# EAGLE design usb2lds_v2.0 (EAGLE 6.5.0)
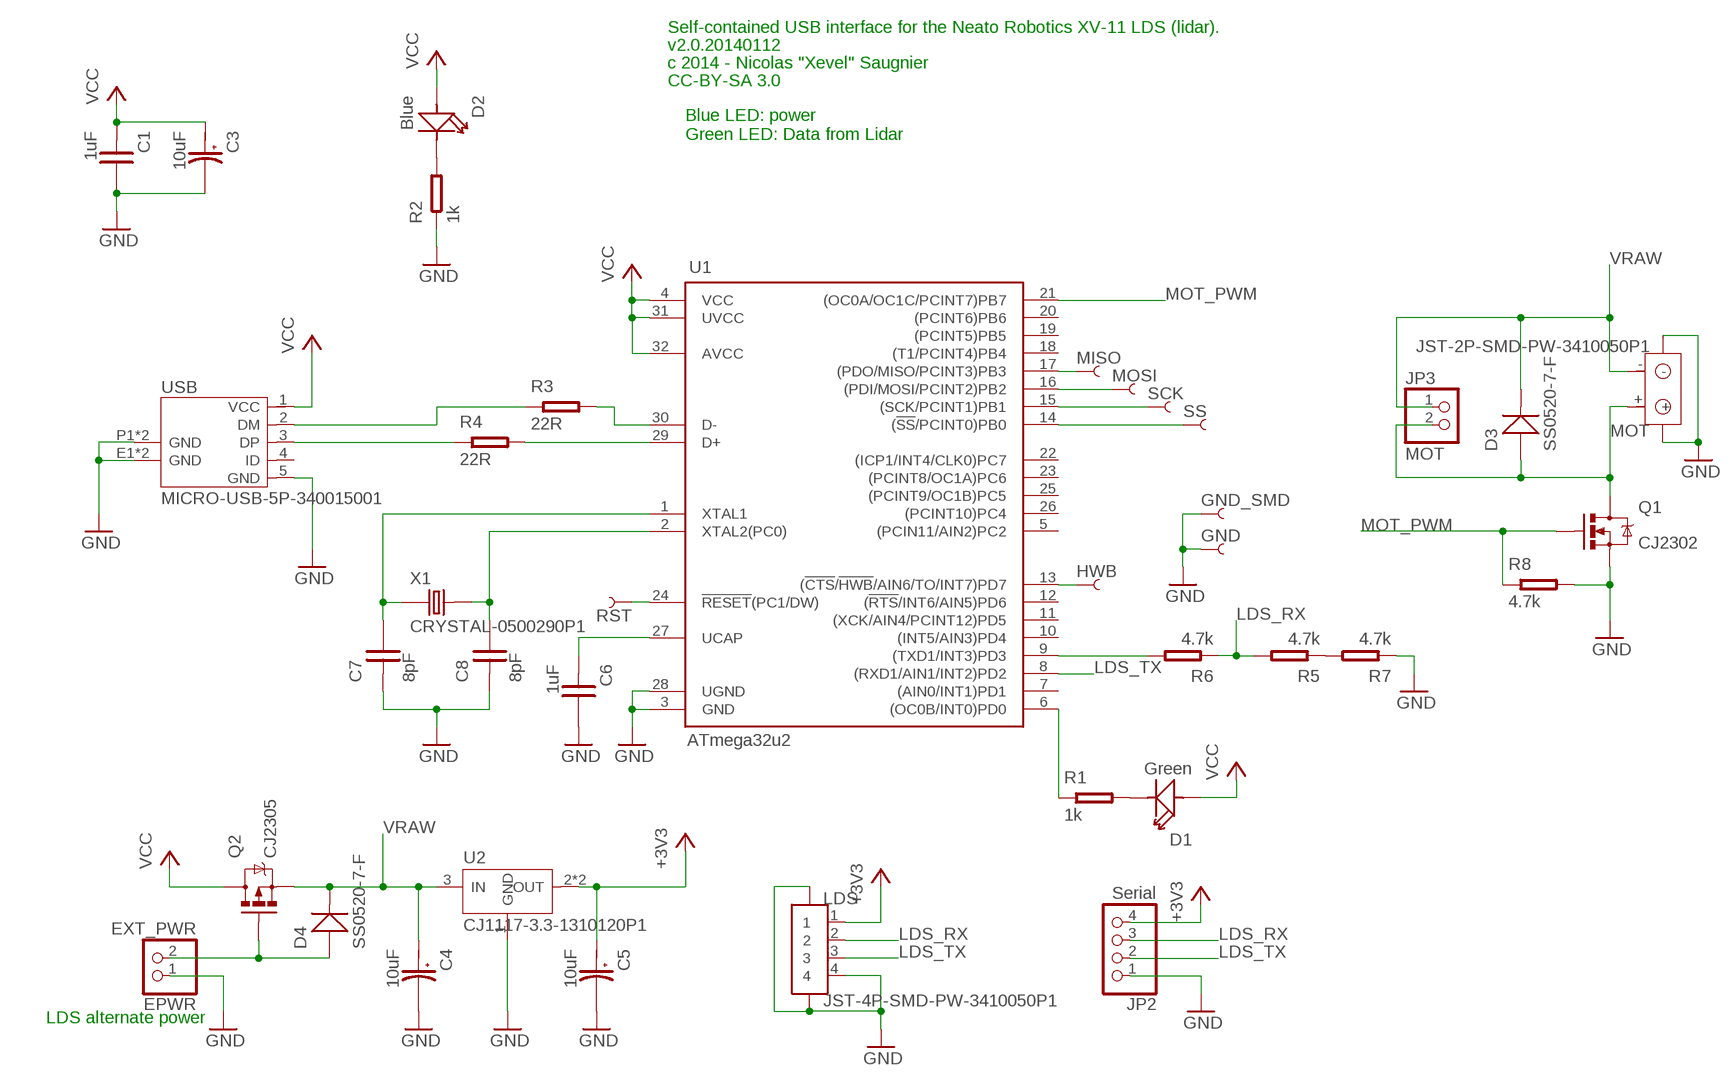
[diagram p0: schematic, sheet 1]

## Parts
C1  1uF  C-0603  [C0603]
C3  10uF  C-POLAR-A  [AVX-A]
C4  10uF  C-POLAR-A  [AVX-A]
C5  10uF  C-POLAR-A  [AVX-A]
C6  1uF  C-0603  [C0603]
C7  8pF  C-0603  [C0603]
C8  8pF  C-0603  [C0603]
D1  Green  LED  [LED0603]
D2  Blue  LED  [LED0603]
D3  SS0520-7-F  D-SOD-123  [SOD123]
D4  SS0520-7-F  D-SOD-123  [SOD123]
EPWR  EXT_PWR  PINHD-1X2  [1X02]
GND  PIN_SMD_2X2.5  [PIN_SMD_2X2.5]
GND_SMD  PIN_SMD_2X2.5  [PIN_SMD_2X2.5]
HWB  PIN_SMD_2X2.5  [PIN_SMD_2X2.5]
JP2  Serial  PINHD-1X4  [1X04]
JP3  MOT  PINHD-1X2  [1X02]
LDS  JST-4P-SMD-PW-3410050P1  [CON-4P-SMD-2.0-90D]
MISO  PIN_SMD_2X2.5  [PIN_SMD_2X2.5]
MOSI  PIN_SMD_2X2.5  [PIN_SMD_2X2.5]
MOT  JST-2P-SMD-PW-3410050P1  [2P-SMD-2.0-90D]
Q1  CJ2302  MOSFET_N_SOT23-3  [SOT-23-3_N/SSOT-3_N]
Q2  CJ2305  MOSFET_P_FDN308P  [SOT-23-3_N/SSOT-3_N]
R1  1k  R-0603  [R0603]
R2  1k  R-0603  [R0603]
R3  22R  R-0603  [R0603]
R4  22R  R-0603  [R0603]
R5  4.7k  R-0603  [R0603]
R6  4.7k  R-0603  [R0603]
R7  4.7k  R-0603  [R0603]
R8  4.7k  R-0603  [R0603]
RST  PIN_SMD_2X2.5  [PIN_SMD_2X2.5]
SCK  PIN_SMD_2X2.5  [PIN_SMD_2X2.5]
SS  PIN_SMD_2X2.5  [PIN_SMD_2X2.5]
U1  ATmega32u2  IC_ATMEGAXXU2-MU_L_MOD  [QFN-32_50P_L_MOD]
U2  CJ1117-3.3-1310120P1  [SOT89]
USB  MICRO-USB-5P-340015001  [B-SMD-5P]
X1  CRYSTAL-0500290P1  [2P-SMD-5.0X3.2]

## Nets
+3V3: C5.+ JP2.4 LDS.1 U2.2(OUT) U2.4(OUT)
GND: C1.2 C3.- C4.- C5.- C6.2 C7.1 C8.1 EPWR.1 GND.PIN GND_SMD.PIN JP2.1 LDS.4 LDS.5 LDS.6 MOT.3 MOT.4 Q1.2(S) R2.1 R7.1 R8.2 U1.3(GND) U1.28(UGND) U2.1(GND) USB.5(GND) USB.E1(GND) USB.E2(GND) USB.P1(GND) USB.P2(GND)
HWB: HWB.PIN U1.13((!CTS!/!HWB!/AIN6/TO/INT7)PD7)
LDS_RX: JP2.3 LDS.2 R5.2 R6.1
LDS_TX: JP2.2 LDS.3 U1.8((RXD1/AIN1/INT2)PD2)
MOT_PWM: Q1.1(G) R8.1 U1.21((OC0A/OC1C/PCINT7)PB7)
N$1: R6.2 U1.9((TXD1/INT3)PD3)
N$2: R1.1 U1.6((OC0B/INT0)PD0)
N$3: C6.1 U1.27(UCAP)
N$4: D3.+ JP3.2 MOT.+ Q1.3(D)
N$5: C8.2 U1.2(XTAL2(PC0)) X1.2
N$6: D1.- R1.2
N$7: D2.- R2.2
N$9: C7.2 U1.1(XTAL1) X1.1
N$10: R5.1 R7.2
N$15: R3.2 U1.30(D-)
N$16: R4.2 U1.29(D+)
N$17: R3.1 USB.2(DM)
N$18: R4.1 USB.3(DP)
N$22: MISO.PIN U1.17((PDO/MISO/PCINT3)PB3)
N$23: MOSI.PIN U1.16((PDI/MOSI/PCINT2)PB2)
N$24: SCK.PIN U1.15((SCK/PCINT1)PB1)
N$25: SS.PIN U1.14((!SS!/PCINT0)PB0)
RST: RST.PIN U1.24(!RESET!(PC1/DW))
VCC: C1.1 C3.+ D1.+ D2.+ Q2.3(D) U1.4(VCC) U1.31(UVCC) U1.32(AVCC) USB.1(VCC)
VRAW: C4.+ D3.- D4.- JP3.1 MOT.- Q2.2(S) U2.3(IN)
VUSB: D4.+ EPWR.2 Q2.1(G)
Unconnected: U1.5((PCIN11/AIN2)PC2) U1.7((AIN0/INT1)PD1) U1.10((INT5/AIN3)PD4) U1.11((XCK/AIN4/PCINT12)PD5) U1.12((!RTS!/INT6/AIN5)PD6) U1.18((T1/PCINT4)PB4) U1.19((PCINT5)PB5) U1.20((PCINT6)PB6) U1.22((ICP1/INT4/CLK0)PC7) U1.23((PCINT8/OC1A)PC6) U1.25((PCINT9/OC1B)PC5) U1.26((PCINT10)PC4) USB.4(ID)

## Notes on the sheet
- Self-contained USB interface for the Neato Robotics XV-11 LDS (lidar).
- v2.0.20140112
- c 2014 - Nicolas "Xevel" Saugnier
- CC-BY-SA 3.0
- Blue LED: power
  Green LED: Data from Lidar
- LDS alternate power

## Library data of the parts
C1 C6-C8 = OPL:C*
C3-C5 = OPL:C-POLAR*
D1 D2 = OPL:LED*: LED
D3 D4 = OPL:D*: DIODE
EPWR JP3 = pinhead:PINHD-1X2: PIN HEADER
GND GND_SMD HWB MISO MOSI RST SCK SS = Xevelabs:PIN
JP2 = pinhead:PINHD-1X4: PIN HEADER
LDS = Xevelabs:JST-4P-SMD-PW
MOT = OPL:JST-2P-SMD-PW
Q1 = Xevelabs:MOSFET_N
Q2 = Xevelabs:MOSFET_P
R1-R8 = OPL:R*
U1 = Xevelabs:IC_ATMEGAXXU2
U2 = OPL:CJ1117-3.3: 1A Low Dropout Linear Regulator
USB = OPL:MICRO-USB-5P: ST-USB-001E：MICRO USB B SMD R/A
X1 = OPL:CRYSTAL*

## Board
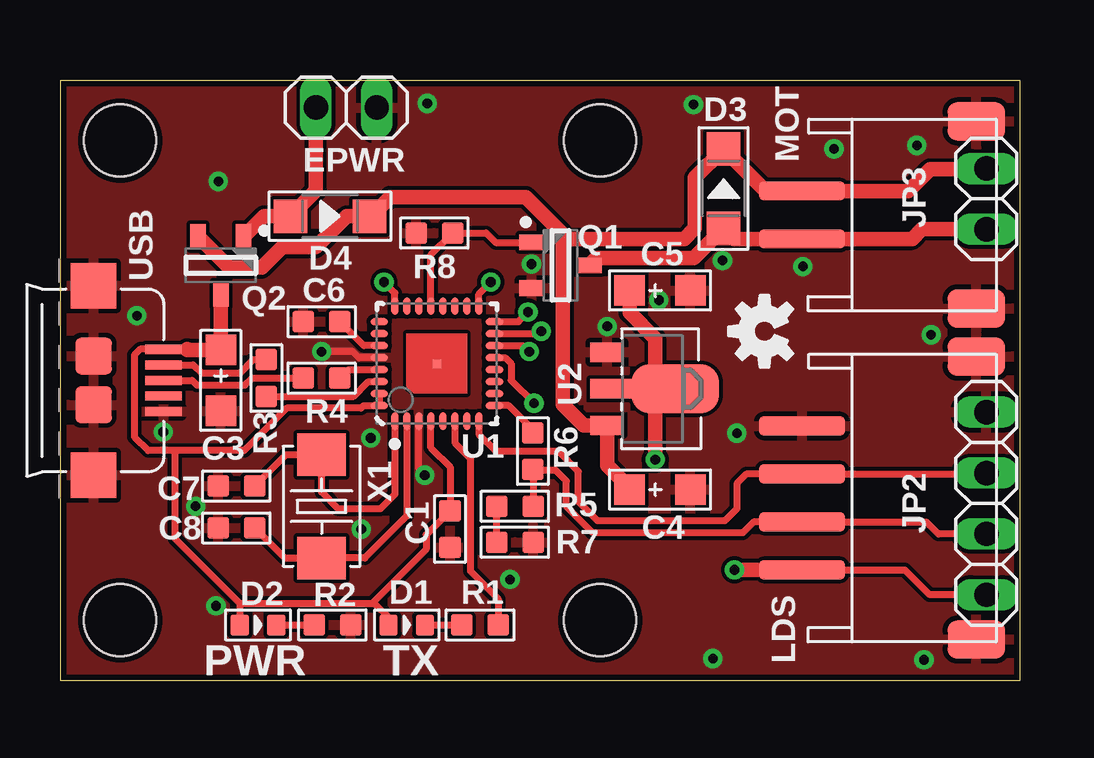
[diagram p1: board, top side]
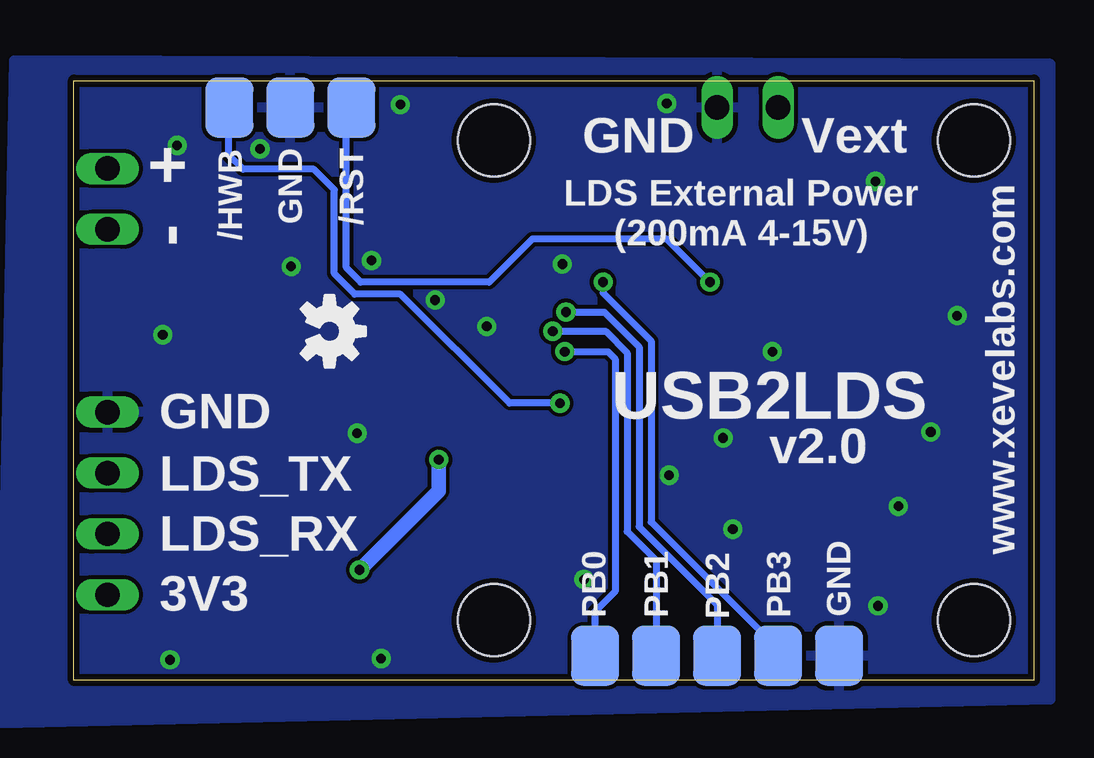
[diagram p2: board, bottom side, seen from below]

Size 40 x 25 mm. Coordinates in mm from the lower left corner, seen from the top.
Outline: 0,0 40,0 40,25 0,25 0,0
Copper layers (1*16): Top 0.035mm / dielectric 1.55mm / Bottom 0.035mm
Design rules "Xevelabs_6mil_eurocircuits": minimum track width 0.15mm, minimum drill 0.25mm, track to track 0.155mm, track to pad 0.155mm, pad to pad 0.155mm, via to via 0.155mm, smd to smd 0mil, copper to edge 0.25mm, drill to drill 0.25mm, minimum pad ring 0mil, minimum via ring 0.2mm, stop-mask expansion 0mil, vias tented up to drill 100mil, thermal gap 0.2mm
Holes 3 mm at 2.5,2.5 2.5,22.5 22.5,22.5 22.5,2.5

### Footprints (pad centres in the part's own frame; a part is rotated, then mirrored left to right if it is on the bottom)
C0603 = smd 0.889 x 0.889: 1 -0.762,0; 2 0.762,0
AVX-A = smd 1.27 x 1.27: + -1.27,0; - 1.27,0
LED0603 = smd 0.762 x 0.889: + -0.762,0; - 0.762,0
SOD123 = smd 1.397 x 1.397: + -1.651,0; - 1.651,0
1X02 = drill 1.016 long: 1 -1.27,0; 2 1.27,0
PIN_SMD_2X2.5 = smd 2.5 x 2: PIN 0,0
1X04 = drill 1.016 long: 1 -3.81,0; 2 -1.27,0; 3 1.27,0; 4 3.81,0
CON-4P-SMD-2.0-90D = smd 0.8 x 3.6: 1 -3,5.08; 2 -1,5.08; 3 1,5.08; 4 3,5.08 | smd 1.6 x 2.4: 5 -5.9,-2.181; 6 5.9,-2.181
2P-SMD-2.0-90D = smd 1.6 x 2.4: 3 3.9,-2.181; 4 -3.9,-2.181 | smd 0.8 x 3.6: + -1,5.08; - 1,5.08
SOT-23-3_N/SSOT-3_N = smd 1.05 x 0.65: 1 -1.2,0.95; 2 -1.2,-0.95; 3 1.2,0
R0603 = smd 0.889 x 0.889: 1 -0.762,0; 2 0.762,0
QFN-32_50P_L_MOD = smd 0.75 x 0.3: 1 -2.4,1.75; 2 -2.4,1.25; 3 -2.4,0.75; 4 -2.4,0.25; 5 -2.4,-0.25; 6 -2.4,-0.75; 7 -2.4,-1.25; 8 -2.4,-1.75; 17 2.4,-1.75; 18 2.4,-1.25; 19 2.4,-0.75; 20 2.4,-0.25; 21 2.4,0.25; 22 2.4,0.75; 23 2.4,1.25; 24 2.4,1.75 | smd 0.3 x 0.75: 9 -1.75,-2.4; 10 -1.25,-2.4; 11 -0.75,-2.4; 12 -0.25,-2.4; 13 0.25,-2.4; 14 0.75,-2.4; 15 1.25,-2.4; 16 1.75,-2.4; 25 1.75,2.4; 26 1.25,2.4; 27 0.75,2.4; 28 0.25,2.4; 29 -0.25,2.4; 30 -0.75,2.4; 31 -1.25,2.4; 32 -1.75,2.4 | smd 0.35 x 0.35: 33 0,0
SOT89 = smd 0.8 x 1.4: 1 -1.524,-1.905; 3 1.524,-1.905 | smd 0.8 x 1.9: 2 0,-1.651 | smd 2.032 x 3.65: 4 0,0.94
B-SMD-5P = smd 0.38 x 1.52: 1 -1.3,2.921; 2 -0.65,2.921; 3 0,2.921; 4 0.65,2.921; 5 1.3,2.921 | smd 1.524 x 1.524: E1 -1.016,0; E2 1.016,0 | smd 1.9 x 1.9: P1 -3.95,0; P2 3.95,0
2P-SMD-5.0X3.2 = smd 1.778 x 2.032: 1 -2.159,0; 2 2.159,0

### Placement (x,y rotation side)
C1  16.25,6.3 270 top
C3  6.7,12.5 270 top
C4  25,7.95 0 top
C5  25,16.25 0 top
C6  10.9,14.95 180 top
C7  7.35,8.1 0 top
C8  7.35,6.35 0 top
D1  14.45,2.3 0 top
D2  8.25,2.3 0 top
D3  27.65,20.5 90 top
D4  11.25,19.35 0 top
EPWR  11.93,23.88 180 top
GND  30.98,23.88 270 bottom
GND_SMD  8.12,1.02 270 bottom
HWB  33.52,23.88 270 bottom
JP2  38.6,7.37 270 top
JP3  38.6,20.07 270 top
LDS  36,7.6 90 top
MISO  10.66,1.02 270 bottom
MOSI  13.2,1.02 270 bottom
MOT  36,19.4 90 top
Q1  20.85,17.3 0 top
Q2  6.7,17.3 270 top
R1  17.5,2.3 180 top
R2  11.35,2.3 180 top
R3  8.6,12.6 270 top
R4  10.9,12.6 0 top
R5  18.95,7.25 0 top
R6  19.7,9.55 90 top
R7  18.95,5.75 180 top
R8  15.6,18.65 180 top
RST  28.44,23.88 270 bottom
SCK  15.74,1.02 270 bottom
SS  18.28,1.02 270 bottom
U1  15.7,13.2 90 top
U2  24.7,12.15 270 top
U$1  [OSHW-LOGO-S]  29.35,14.55 90 top
U$2  [OSHW-LOGO-S]  29.35,14.55 270 bottom
USB  1.4,12.5 270 top
X1  10.9,7.25 270 top

### Tracks (layer width: path | path; a pad name or v marks a point on that pad's centre or on a via)
+3V3  (via drill 0.4)
  Top 0.3: LDS.1 35.2,4.6 36.24,3.56 JP2.4
  Top 0.6: U2.2 24.8,12.15 | 24.8,12.15 U2.4 | C5.+ 23.73,15.32 24.8,14.25 24.8,12.15 | LDS.1 v28.1,4.6 | v24.8,9.2 24.8,12.15
  Bottom 0.6: v28.1,4.6 24.8,7.9 v24.8,9.2
GND  (via drill 0.4)
  Top 0.3: U1.28 12.45,13.45 12.2,13.7 v10.9,13.7 | v15.2,8.55 14.95,8.8 U1.3
  other vias: 6.6,20.8 4.3,10.35 3.2,15.2 15.3,24.05 12.55,6.3 28.2,10.3 30.95,17.25 36.3,14.4 35.7,22.3 22.8,14.75 27.2,0.9 6.5,3.1 5.65,7.25 12.95,10.1 19.65,17.35 32.25,22.15 27.6,17.5 18.75,4.2 36,0.85 26.4,24 24.95,15.85
  pour Bottom: -0.6,25.7 42.5,25.85 43.1,-1.8 -0.7,-0.8 -0.7,25.7
  pour Top: -1.3,25.9 43.6,27.45 42.4,-1.35 -1.3,-0.6
HWB  (via drill 0.4)
  Top 0.3: U1.13 18.55,13.45 18.8,13.2 18.8,12.5 v19.75,11.55
  Bottom 0.3: v19.75,11.55 21.85,11.55 26.4,16.1 28.3,16.1 29.15,16.95 29.15,20.45 30,21.3 32.95,21.3 33.55,21.9 33.55,23.85 HWB.PIN
LDS_RX
  Top 0.3: R5.2 19.71,8.78 R6.1 19.74,8.75 20.65,8.75 21.1,8.3 21.1,7.25 22.2,6.15 28.45,6.15 28.9,6.6 LDS.2 36.1,6.6 36.6,6.1 JP2.3
LDS_TX
  Top 0.3: U1.8 17.45,10.25 18.15,9.55 20.75,9.55 21.6,8.7 21.6,7.45 22.4,6.65 27.7,6.65 28.2,7.15 28.2,8.2 28.6,8.6 LDS.3 38.56,8.6 JP2.2
MOT_PWM
  Top 0.3: U1.21 15.45,17.74 R8.1 17.75,18.65 18.15,18.25 Q1.1
N$1
  Top 0.3: U1.9 18.7,11.45 19.7,10.45 R6.2
N$2
  Top 0.3: U1.6 16.45,9.9 17.1,9.25 17.1,4.55 18.25,3.4 18.25,2.31 R1.1
N$3
  Top 0.3: U1.27 12.66,13.95 C6.1
N$4
  Top 0.6: Q1.3 22.35,17.6 26.4,17.6 D3.+ 28.1,18.4 MOT.+ 35.5,18.4 35.9,18.8 JP3.2
N$5
  Top 0.3: C8.2 9.37,5.09 X1.2 12.7,5.1 14.45,6.85 U1.2
N$6
  Top 0.3: D1.- R1.2
N$7
  Top 0.3: D2.- R2.2
N$9
  Top 0.3: C7.2 9.42,9.41 X1.1 10.9,7.85 11.6,7.15 13.35,7.15 13.95,7.75 U1.1
N$10
  Top 0.3: R7.2 R5.1
N$15
  Top 0.3: R3.2 12.24,11.84 12.85,12.45 U1.30
N$16
  Top 0.3: R4.2 12.01,12.95 U1.29
N$17
  Top 0.3: USB.2 5.55,13.15 5.9,12.8 7.5,12.8 8.06,13.36 R3.1
N$18
  Top 0.3: USB.3 5.5,12.5 5.7,12.3 7.7,12.3 8,12.6 R4.1
N$22  (via drill 0.4)
  Top 0.3: U1.17 17.45,16.1 v17.95,16.6
  Bottom 0.3: v17.95,16.6 17.95,16.15 15.95,14.15 15.95,6.6 10.66,1.31 MISO.PIN
N$23  (via drill 0.4)
  Top 0.3: U1.16 19.1,14.95 v19.5,15.35
  Bottom 0.3: v19.5,15.35 17.9,15.35 16.45,13.9 16.45,6.4 13.2,3.15 MOSI.PIN
N$24  (via drill 0.4)
  Top 0.3: U1.15 19.95,14.45 v20.05,14.55
  Bottom 0.3: v20.05,14.55 17.85,14.55 16.95,13.65 16.95,6.2 15.74,4.99 SCK.PIN
N$25  (via drill 0.4)
  Top 0.3: U1.14 19.3,13.95 v19.55,13.7
  Bottom 0.3: v19.55,13.7 17.75,13.7 17.45,13.4 17.45,3.7 18.3,2.85 18.3,1.04 SS.PIN
RST  (via drill 0.4)
  Top 0.3: U1.24 13.95,16.15 v13.5,16.6
  Bottom 0.3: RST.PIN 28.65,23.88 28.65,17.2 28.05,16.6 22.7,16.6 20.9,18.4 15.3,18.4 v13.5,16.6
VCC
  Top 0.3: 5.3,13.8 USB.1 3.35,13.8 3.1,13.55 3.1,10.15 3.67,9.57 4.78,9.57 | U1.31 U1.32 12.65,11.45 12.55,11.35 9.45,11.35 7.67,9.57 4.78,9.57 | 4.78,9.57 4.78,5.92 7.49,3.21 | 7.49,3.21 D2.+ | 7.49,3.21 13.09,3.21 | 13.09,3.21 13.69,2.61 D1.+ | U1.4 15.45,9.69 16.25,8.89 C1.1 15.25,6.06 15.25,5.45 13.09,3.29 13.09,3.21
  Top 0.6: 5.3,13.8 5.3,13.77 C3.+ Q2.3
VRAW
  Top 0.6: C4.+ 23.73,8.02 22.8,8.95 U2.3 21.82,10.63 20.95,11.5 20.95,18.4 | Q2.2 7.05,17.2 8.4,17.2 9.25,18.05 10.65,18.05 11.95,19.35 D4.- 12.95,19.35 13.75,20.15 19.4,20.15 20.95,18.6 20.95,18.4 | 20.95,18.4 26,18.4 26.45,18.85 26.45,20.95 D3.- 29.4,20.4 MOT.- 35.35,20.4 36.25,21.3 38.56,21.3 JP3.1
VUSB
  Top 0.6: Q2.1 8.5,19.35 D4.+ 10.66,20.41 EPWR.2

### Text on the board
tPlace: PWR | TX
bNames: GND | Vext | /RST | GND | /HWB | www.xevelabs.com | + | LDS External Power / (200mA 4-15V) | - | USB2LDS | v2.0 | GND | LDS_TX | LDS_RX | GND | PB3 | PB2 | PB1 | PB0 | 3V3